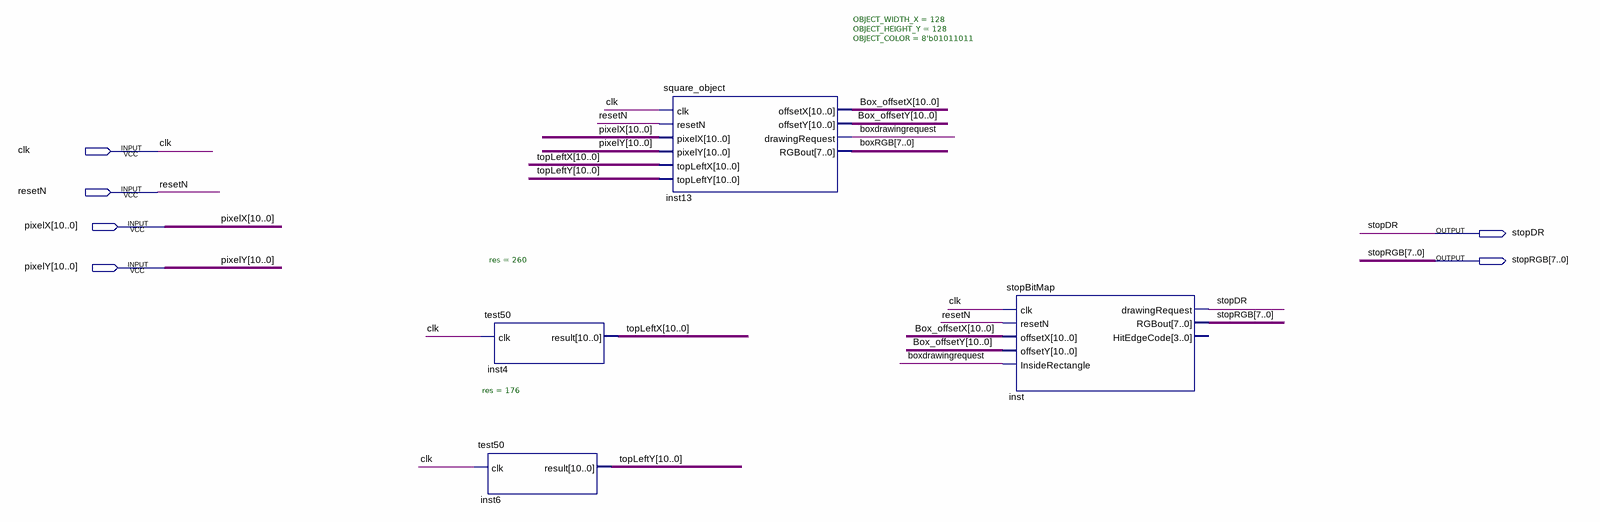
[diagram p0: schematic sheet]
// Quartus schematic stop_block.bdf as structural Verilog: 4 symbols, 6 pins
module stop_block (
  input  clk,
  input  resetN,
  input  [10:0] pixelX,
  input  [10:0] pixelY,
  output stopDR,
  output [7:0] stopRGB
);

  wire boxdrawingrequest;
  wire [7:0] boxRGB;
  wire [10:0] Box_offsetX, Box_offsetY, topLeftX, topLeftY;

  test50 #(.res(260)) inst4 (.clk(clk), .result(topLeftX));
  test50 #(.res(176)) inst6 (.clk(clk), .result(topLeftY));
  square_object #(.OBJECT_WIDTH_X(128), .OBJECT_HEIGHT_Y(128), .OBJECT_COLOR(8'b01011011)) inst13 (
    .clk(clk), .resetN(resetN), .pixelX(pixelX), .pixelY(pixelY), .topLeftX(topLeftX), .topLeftY(topLeftY),
    .offsetX(Box_offsetX), .offsetY(Box_offsetY), .drawingRequest(boxdrawingrequest), .RGBout(boxRGB));
  stopBitMap inst (
    .clk(clk), .resetN(resetN), .offsetX(Box_offsetX), .offsetY(Box_offsetY),
    .InsideRectangle(boxdrawingrequest), .drawingRequest(stopDR), .RGBout(stopRGB));  // open: HitEdgeCode
endmodule
